# Altium schematic sheet [05] RTCvsMMC.SchDoc
size A
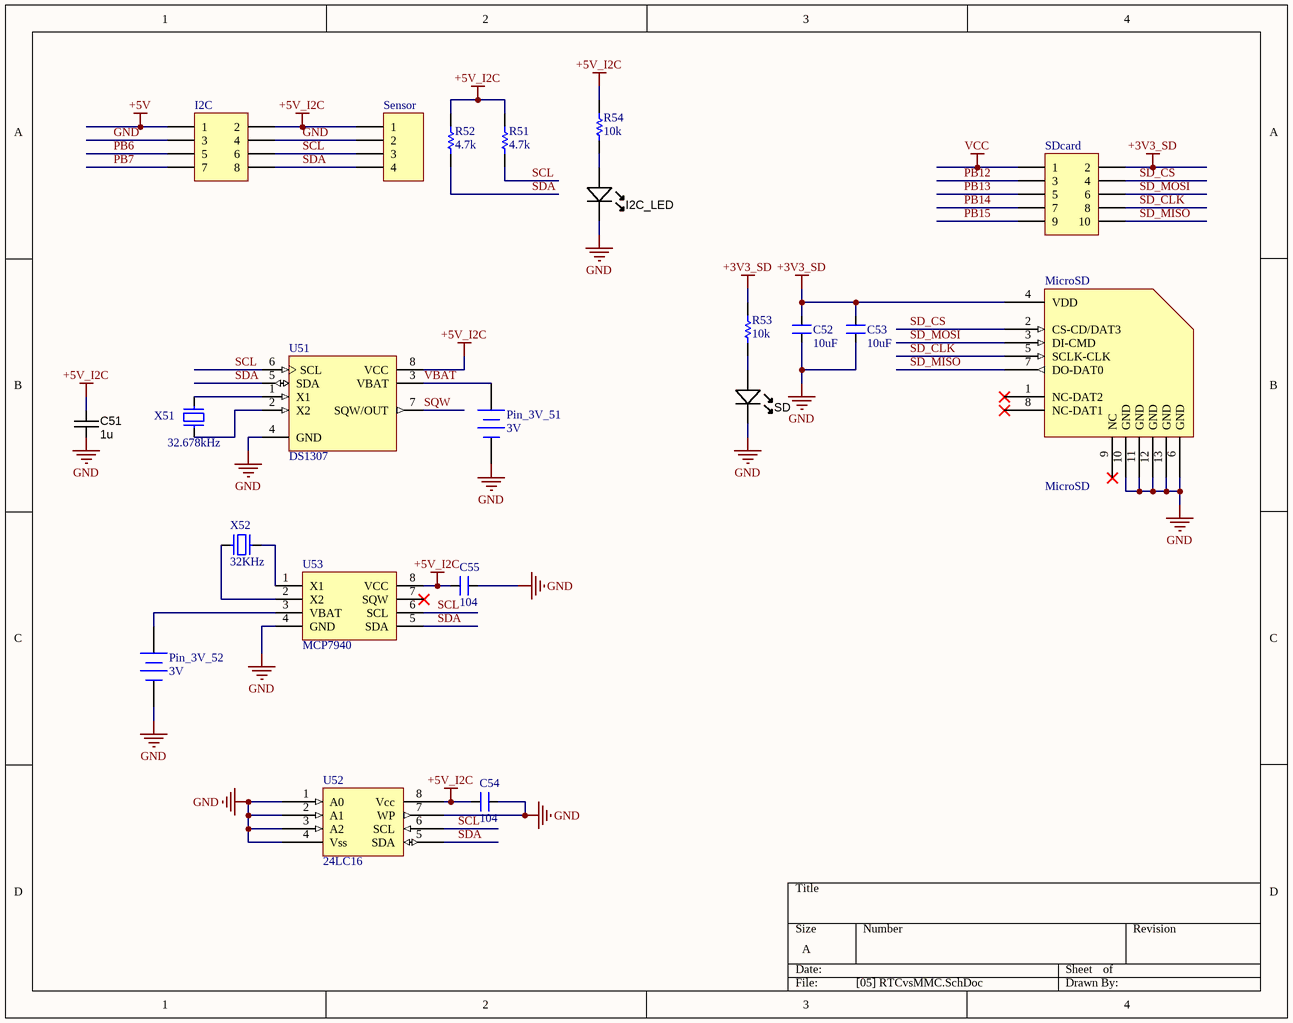
[diagram p0: [05] RTCvsMMC.SchDoc]

## Parts
C51  value 1u  [CAPC1608N]  (hidden comment: approved sub OK)
C52  value 10uF  [CAPC2012N_F]  (hidden comment: CAP NP)
C53  value 10uF  [CAPC2012N_F]  (hidden comment: CAP NP)
C54  value 104  [CAPC2012N_F]  (hidden comment: CAP NP)
C55  value 104  [CAPC2012N_F]  (hidden comment: CAP NP)
I2C  Header 4X2  [HDR2X4]  (value not drawn)
I2C_LED  Green  [LED-0805-K]  (value not drawn)
MicroSD  MicroSD  [microsd]
Pin_3V_51  3V  [CR1220]
Pin_3V_52  3V  [CR1220]
R51  value 4.7k  [RESC1608N_ZERO]  (hidden comment: Res)
R52  value 4.7k  [RESC1608N_ZERO]  (hidden comment: Res)
R53  value 10k  [RESC1608N_ZERO]  (hidden comment: Res)
R54  value 10k  [RESC1608N_ZERO]  (hidden comment: Res)
SD  Green  [LED-0805-K]  (value not drawn)
SDcard  Header 5X2  [HDR2X5]  (value not drawn)
Sensor  Header 4  [HDR1X4]  (value not drawn)
U51  DS1307  [SOIC127P600X175-8AN]
U52  24LC16  [SOIC-8]
U53  MCP7940  [SOIC-8]
X51  32.678kHz  [XTminiv2]
X52  32KHz  [XTminiv2]

## Nets
+3V3_SD: C52.2 C53.2 MicroSD.4(VDD) R53.2 SDcard.2
+5V: I2C.1
+5V_I2C: C51.1 C54.1 C55.1 I2C.2 R51.2 R52.2 R54.2 Sensor.1 U51.8(VCC) U52.8(Vcc) U53.8(VCC)
GND: C51.2 C52.1 C53.1 C54.2 C55.2 I2C.3 I2C.4 I2C_LED.K MicroSD.6(GND) MicroSD.10(GND) MicroSD.11(GND) MicroSD.12(GND) MicroSD.13(GND) Pin_3V_51.2(-) Pin_3V_52.2(-) SD.K Sensor.2 U51.4(GND) U52.1(A0) U52.2(A1) U52.3(A2) U52.4(Vss) U52.7(WP) U53.4(GND)
VCC: SDcard.1
PB6: I2C.5
PB7: I2C.7
PB12: SDcard.3
PB13: SDcard.5
PB14: SDcard.7
PB15: SDcard.9
SCL: I2C.6 R51.1 Sensor.3 U51.6(SCL) U52.6(SCL) U53.6(SCL)
SD_CLK: MicroSD.5(SCLK-CLK) SDcard.8
SD_CS: MicroSD.2(CS-CD/DAT3) SDcard.4
SD_MISO: MicroSD.7(DO-DAT0) SDcard.10
SD_MOSI: MicroSD.3(DI-CMD) SDcard.6
SDA: I2C.8 R52.1 Sensor.4 U51.5(SDA) U52.5(SDA) U53.5(SDA)
SQW: U51.7(SQW/OUT)
VBAT: Pin_3V_51.1(+) U51.3(VBAT)
NetI2C_LED_A: I2C_LED.A R54.1
NetPin_3V_52_1: Pin_3V_52.1(+) U53.3(VBAT)
NetR53_1: R53.1 SD.A
NetU51_1: U51.1(X1) X51.1
NetU51_2: U51.2(X2) X51.2
NetU53_1: U53.1(X1) X52.1
NetU53_2: U53.2(X2) X52.2

Not connected (* = marked no-connect by the designer): MicroSD 1(NC-DAT2)* 8(NC-DAT1)* 9(NC)*; U53 7(SQW)*

## Library data of the parts
C51 = CAPC_1n_0603_100V: Capacitor SMD Cer 1nF 10% 100V X7R 0603; Manufacturer 1: Murata Electronics North America; Manufacturer Part Number 1: GCM188R72A102KA37D; Ratings: 100V; X7R; Material: ceramic; Package / Case: 0603 (1608 metric); Tolerance: ±10%; Supplier 1: Digi-Key; Supplier Part Number 1: 490-4780-1-ND; Operating Temperature: -55°C ~ 125°C; Size / Dimension: 0.063" L x 0.031" W (1.60mm x 0.80mm); Thickness (Max): 0.035" (0.90mm); ComponentLink1URL: http://search.murata.co.jp/Ceramy/image/img/PDF/ENG/GCM188R72A102KA37.pdf; ComponentLink1Description: http://search.murata.co.jp/Ceramy/image/img/PDF/ENG/GCM188R72A102KA37.pdf
I2C = Header 4X2: Header, 4-Pin, Dual row; LatestRevisionDate: 17-Jul-2002; LatestRevisionNote: Re-released for DXP Platform.; Publisher: Altium Limited
I2C_LED SD = LED_SMD_Green_0805: LED, 0805 SMD, Green; Manufacturer 1: Ligitek; Manufacturer Part Number 1: LG170G-CT; Ratings: 10 mcd; 573 nm; Package / Case: 0805; Material: GaP
Pin_3V_51 Pin_3V_52 = Battery: Multicell Battery; Published: 24-Mar-1999; LatestRevisionDate: 17-Jul-2002; LatestRevisionNote: Re-released for DXP Platform.; PackageReference: BAT-2; Publisher: Altium Limited
SDcard = Header 5X2: Header, 5-Pin, Dual row; LatestRevisionDate: 17-Jul-2002; LatestRevisionNote: Re-released for DXP Platform.; Publisher: Altium Limited
Sensor = Header 4: Header, 4-Pin; LatestRevisionDate: 17-Jul-2002; LatestRevisionNote: Re-released for DXP Platform.; Publisher: Altium Limited
U52 = 24LC04B
U53 = DS1307: Real Timer Serial; Value: DS1307
X51 = Crystal
X52 = XT2: Crystal For all Crystal 2pin.; Value: 4Mhz